# EAGLE schematic fs7_redraw (EAGLE 8.5.1)
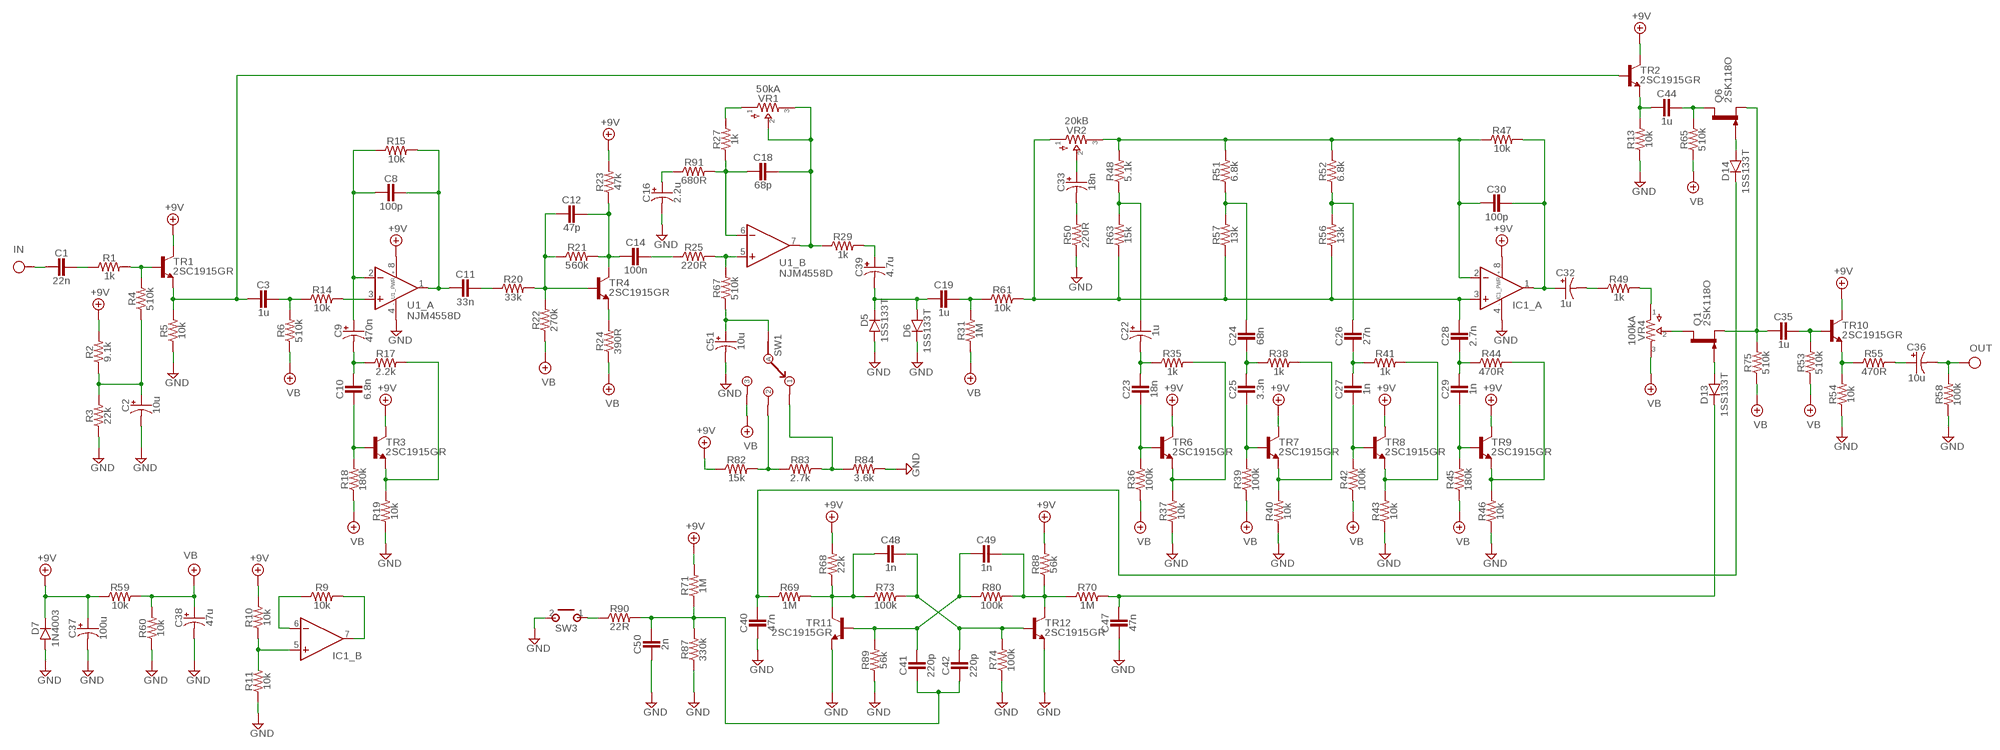
[diagram p0: schematic, sheet 1]

## Parts
C1  22n  CER/FILMBOX.1  [BOX_SMALL]
C2  10u  0400  [040_020]
C3  1u  CER/FILMBOX.1  [BOX_SMALL]
C8  100p  CER/FILMBOX.1  [BOX_SMALL]
C9  470n  0400  [040_020]
C10  6.8n  CER/FILMBOX.1  [BOX_SMALL]
C11  33n  CER/FILMBOX.1  [BOX_SMALL]
C12  47p  CER/FILMBOX.1  [BOX_SMALL]
C14  100n  CER/FILMBOX.1  [BOX_SMALL]
C16  2.2u  0400  [040_020]
C18  68p  CER/FILMBOX.1  [BOX_SMALL]
C19  1u  CER/FILMBOX.1  [BOX_SMALL]
C22  1u  0400  [040_020]
C23  18n  CER/FILMBOX.1  [BOX_SMALL]
C24  68n  CER/FILMBOX.1  [BOX_SMALL]
C25  3.3n  CER/FILMBOX.1  [BOX_SMALL]
C26  27n  CER/FILMBOX.1  [BOX_SMALL]
C27  1n  CER/FILMBOX.1  [BOX_SMALL]
C28  2.7n  CER/FILMBOX.1  [BOX_SMALL]
C29  1n  CER/FILMBOX.1  [BOX_SMALL]
C30  100p  CER/FILMBOX.1  [BOX_SMALL]
C32  1u  0400  [040_020]
C33  18n  0400  [040_020]
C35  1u  CER/FILMBOX.1  [BOX_SMALL]
C36  10u  0400  [040_020]
C37  100u  0400  [040_020]
C38  47u  0400  [040_020]
C39  4.7u  0400  [040_020]
C40  47n  CER/FILMBOX.1  [BOX_SMALL]
C41  220p  CER/FILMBOX.1  [BOX_SMALL]
C42  220p  CER/FILMBOX.1  [BOX_SMALL]
C44  1u  CER/FILMBOX.1  [BOX_SMALL]
C47  47n  CER/FILMBOX.1  [BOX_SMALL]
C48  1n  CER/FILMBOX.1  [BOX_SMALL]
C49  1n  CER/FILMBOX.1  [BOX_SMALL]
C50  2n  CER/FILMBOX.1  [BOX_SMALL]
C51  10u  0400  [040_020]
D5  1SS133T  DO41.2  [DO41-2]
D6  1SS133T  DO41.2  [DO41-2]
D7  1N4003  DO41.2  [DO41-2]
D13  1SS133T  DO41.2  [DO41-2]
D14  1SS133T  DO41.2  [DO41-2]
IC1  DUALTH  [DIL0]
Q1  2SK118O  2N5457  [TO92-]
Q6  2SK118O  2N5457  [TO92-]
R1  1k  R_.3B  [R0207/3]
R2  9.1k  R_.3B  [R0207/3]
R3  22k  R_.3B  [R0207/3]
R4  510k  R_.3B  [R0207/3]
R5  10k  R_.3B  [R0207/3]
R6  510k  R_.3B  [R0207/3]
R9  10k  R_.3B  [R0207/3]
R10  10k  R_.3B  [R0207/3]
R11  10k  R_.3B  [R0207/3]
R13  10k  R_.3B  [R0207/3]
R14  10k  R_.3B  [R0207/3]
R15  10k  R_.3B  [R0207/3]
R17  2.2k  R_.3B  [R0207/3]
R18  180k  R_.3B  [R0207/3]
R19  10k  R_.3B  [R0207/3]
R20  33k  R_.3B  [R0207/3]
R21  560k  R_.3B  [R0207/3]
R22  270k  R_.3B  [R0207/3]
R23  47k  R_.3B  [R0207/3]
R24  390R  R_.3B  [R0207/3]
R25  220R  R_.3B  [R0207/3]
R27  1k  R_.3B  [R0207/3]
R29  1k  R_.3B  [R0207/3]
R31  1M  R_.3B  [R0207/3]
R35  1k  R_.3B  [R0207/3]
R36  100k  R_.3B  [R0207/3]
R37  10k  R_.3B  [R0207/3]
R38  1k  R_.3B  [R0207/3]
R39  100k  R_.3B  [R0207/3]
R40  10k  R_.3B  [R0207/3]
R41  1k  R_.3B  [R0207/3]
R42  100k  R_.3B  [R0207/3]
R43  10k  R_.3B  [R0207/3]
R44  470R  R_.3B  [R0207/3]
R45  180k  R_.3B  [R0207/3]
R46  10k  R_.3B  [R0207/3]
R47  10k  R_.3B  [R0207/3]
R48  5.1k  R_.3B  [R0207/3]
R49  1k  R_.3B  [R0207/3]
R50  220R  R_.3B  [R0207/3]
R51  6.8k  R_.3B  [R0207/3]
R52  6.8k  R_.3B  [R0207/3]
R53  510k  R_.3B  [R0207/3]
R54  10k  R_.3B  [R0207/3]
R55  470R  R_.3B  [R0207/3]
R56  13k  R_.3B  [R0207/3]
R57  13k  R_.3B  [R0207/3]
R58  100k  R_.3B  [R0207/3]
R59  10k  R_.3B  [R0207/3]
R60  10k  R_.3B  [R0207/3]
R61  10k  R_.3B  [R0207/3]
R63  15k  R_.3B  [R0207/3]
R65  510k  R_.3B  [R0207/3]
R67  510k  R_.3B  [R0207/3]
R68  22k  R_.3B  [R0207/3]
R69  1M  R_.3B  [R0207/3]
R70  1M  R_.3B  [R0207/3]
R71  1M  R_.3B  [R0207/3]
R73  100k  R_.3B  [R0207/3]
R74  100k  R_.3B  [R0207/3]
R75  510k  R_.3B  [R0207/3]
R80  100k  R_.3B  [R0207/3]
R82  15k  R_.3B  [R0207/3]
R83  2.7k  R_.3B  [R0207/3]
R84  3.6k  R_.3B  [R0207/3]
R87  330k  R_.3B  [R0207/3]
R88  56k  R_.3B  [R0207/3]
R89  56k  R_.3B  [R0207/3]
R90  22R  R_.3B  [R0207/3]
R91  680R  R_.3B  [R0207/3]
SW1  1P3T  [1P3T]
SW3  MOMENTARY  [SPST]
TR1  2SC1915GR  2SC828A  [TO92-]
TR2  2SC1915GR  2SC828A  [TO92-]
TR3  2SC1915GR  2SC828A  [TO92-]
TR4  2SC1915GR  2SC828A  [TO92-]
TR6  2SC1915GR  2SC828A  [TO92-]
TR7  2SC1915GR  2SC828A  [TO92-]
TR8  2SC1915GR  2SC828A  [TO92-]
TR9  2SC1915GR  2SC828A  [TO92-]
TR10  2SC1915GR  2SC828A  [TO92-]
TR11  2SC1915GR  2SC828A  [TO92-]
TR12  2SC1915GR  2SC828A  [TO92-]
U1  NJM4558D  DUALTH  [DIL0]
VR1  50kA  POTS16MM  [16MM]
VR2  20kB  POTS16MM  [16MM]
VR4  100kA  POTS16MM  [16MM]

## Nets
+9V: C37.+ D7.C IC1.8(_PWR:V+) R2.2 R10.2 R23.2 R59.1 R68.2 R71.2 R82.1 R88.2 TR1.2(C) TR2.2(C) TR3.2(C) TR6.2(C) TR7.2(C) TR8.2(C) TR9.2(C) TR10.2(C) U1.8(_PWR:V+)
GND: C2.- C16.- C37.- C38.- C40.2 C47.2 C50.2 C51.- D5.A D6.C D7.A IC1.4(_PWR:V-) R3.1 R5.1 R11.1 R13.1 R19.1 R37.1 R40.1 R43.1 R46.1 R50.1 R54.1 R58.1 R60.1 R74.1 R84.2 R87.1 R89.1 SW3.2(S) TR11.3(E) TR12.3(E) U1.4(_PWR:V-)
IN: C1.2
N$1: C1.1 R1.1
N$2: R1.2 R4.2 TR1.1(B)
N$3: C3.2 R5.2 TR1.3(E) TR2.1(B)
N$4: C2.+ R2.1 R3.2 R4.1
N$5: C3.1 R6.2 R14.1
N$6: C9.- C10.1 R17.1
N$7: C11.1 R20.1
N$8: C10.2 R18.2 TR3.1(B)
N$9: R17.2 R19.2 TR3.3(E)
N$10: C8.2 C9.+ R15.1 U1.2(_A:-IN)
N$11: C8.1 C11.2 R15.2 U1.1(_A:OUT)
N$12: C12.2 R20.2 R21.1 R22.2 TR4.1(B)
N$13: R14.2 U1.3(_A:+IN)
N$14: C12.1 C14.2 R21.2 R23.1 TR4.2(C)
N$15: R24.2 TR4.3(E)
N$16: C14.1 R25.1
N$17: IC1.5(_B:+IN) R10.1
N$18: C33.+ VR2.2
N$19: C33.- R50.2
N$20: C30.2 IC1.2(_A:-IN) R47.1 R48.2 R51.2 R52.2 VR2.3
N$21: C22.+ R48.1 R63.2
N$22: C22.- C23.1 R35.1
N$23: C23.2 R36.2 TR6.1(B)
N$24: R35.2 R37.2 TR6.3(E)
N$25: C40.1 D14.C R69.1
N$26: C47.1 D13.C R70.2
N$27: C24.1 R51.1 R57.2
N$28: C24.2 C25.1 R38.1
N$29: C48.2 R68.1 R69.2 R73.1 TR11.2(C)
N$30: C25.2 R39.2 TR7.1(B)
N$31: C49.1 R70.1 R80.2 R88.1 TR12.2(C)
N$32: C41.1 C49.2 R80.1 R89.2 TR11.1(B)
N$33: R38.2 R40.2 TR7.3(E)
N$34: C42.1 C48.1 R73.2 R74.2 TR12.1(B)
N$35: C26.1 R52.1 R56.2
N$36: C41.2 C42.2 C50.1 R71.1 R87.2 R90.2
N$37: C26.2 C27.1 R41.1
N$38: R90.1 SW3.1(P)
N$39: C27.2 R42.2 TR8.1(B)
N$40: R41.2 R43.2 TR8.3(E)
N$41: C28.2 C29.1 R44.1
N$42: C29.2 R45.2 TR9.1(B)
N$43: R44.2 R46.2 TR9.3(E)
N$44: C32.- R49.1
N$45: C30.1 C32.+ IC1.1(_A:OUT) R47.2
N$46: R49.2 VR4.1
N$47: C44.2 R13.2 TR2.3(E)
N$48: C44.1 Q6.3(D) R65.2
N$49: R25.2 R67.2 U1.5(_B:+IN)
N$50: D14.A Q6.1(G)
N$51: C35.2 Q1.2(S) Q6.2(S) R75.2
N$52: Q1.3(D) VR4.2
N$53: D13.A Q1.1(G)
N$54: C35.1 R53.2 TR10.1(B)
N$55: R54.2 R55.1 TR10.3(E)
N$56: C36.+ R55.2
N$57: C51.+ R67.1 SW1.P$1(A)
N$58: C16.+ R91.1
N$59: C18.2 R27.1 R91.2 U1.6(_B:-IN)
N$60: R27.2 VR1.1
N$61: C18.1 R29.1 U1.7(_B:OUT) VR1.2 VR1.3
N$62: C39.+ R29.2
N$63: C19.2 C39.- D5.C D6.A
N$64: C19.1 R31.2 R61.1
N$65: C28.1 IC1.3(_A:+IN) R56.1 R57.1 R61.2 R63.1 VR2.1
N$66: IC1.6(_B:-IN) R9.1
N$67: IC1.7(_B:OUT) R9.2
N$68: R82.2 R83.1 SW1.P$3
N$69: R83.2 R84.1 SW1.P$2
OUT: C36.- R58.2
VB: C38.+ R6.1 R18.1 R22.1 R24.1 R31.1 R36.1 R39.1 R42.1 R45.1 R53.1 R59.2 R60.2 R65.1 R75.1 SW1.P$4 VR4.3
Unconnected: R11.2

## Library data of the parts
C1 C3 C8 C10-C12 C14 C18 C19 C23-C30 C35 C40-C42 C44 C47-C50 = pedals-capacitors-film:CER/FILM: 47 - 120pF Xicon Ceramic Disc 2.5mm lead spacing
C2 C9 C16 C22 C32 C33 C36-C39 C51 = pedals-capacitors-elec:040
D5-D7 D13 D14 = pedals-diodes:DO41: DO-41 Package Diodes: 1N4001 - 1N40019 Zener Diodes: 1N4728 - 1N4764
IC1 U1 = pedals-integrated circuits:DUAL: OP AMP
Q1 Q6 = pedals-transistors:2N5457: N-CHANNEL JFET
R1-R6 R9-R11 R13-R15 R17-R25 R27 R29 R31 R35-R61 R63 R65 R67-R71 R73-R75 R80 R82-R84 R87-R91 = pedals-resistors:R_
SW1 = pedals-switches:1P3T
SW3 = pedals-switches:MOMENTARY
TR1-TR4 TR6-TR12 = pedals-transistors:2SC828A
VR1 VR2 VR4 = pedals-potentiometers:POTS